# EAGLE design led-shift-r1 (EAGLE 6.5.0)
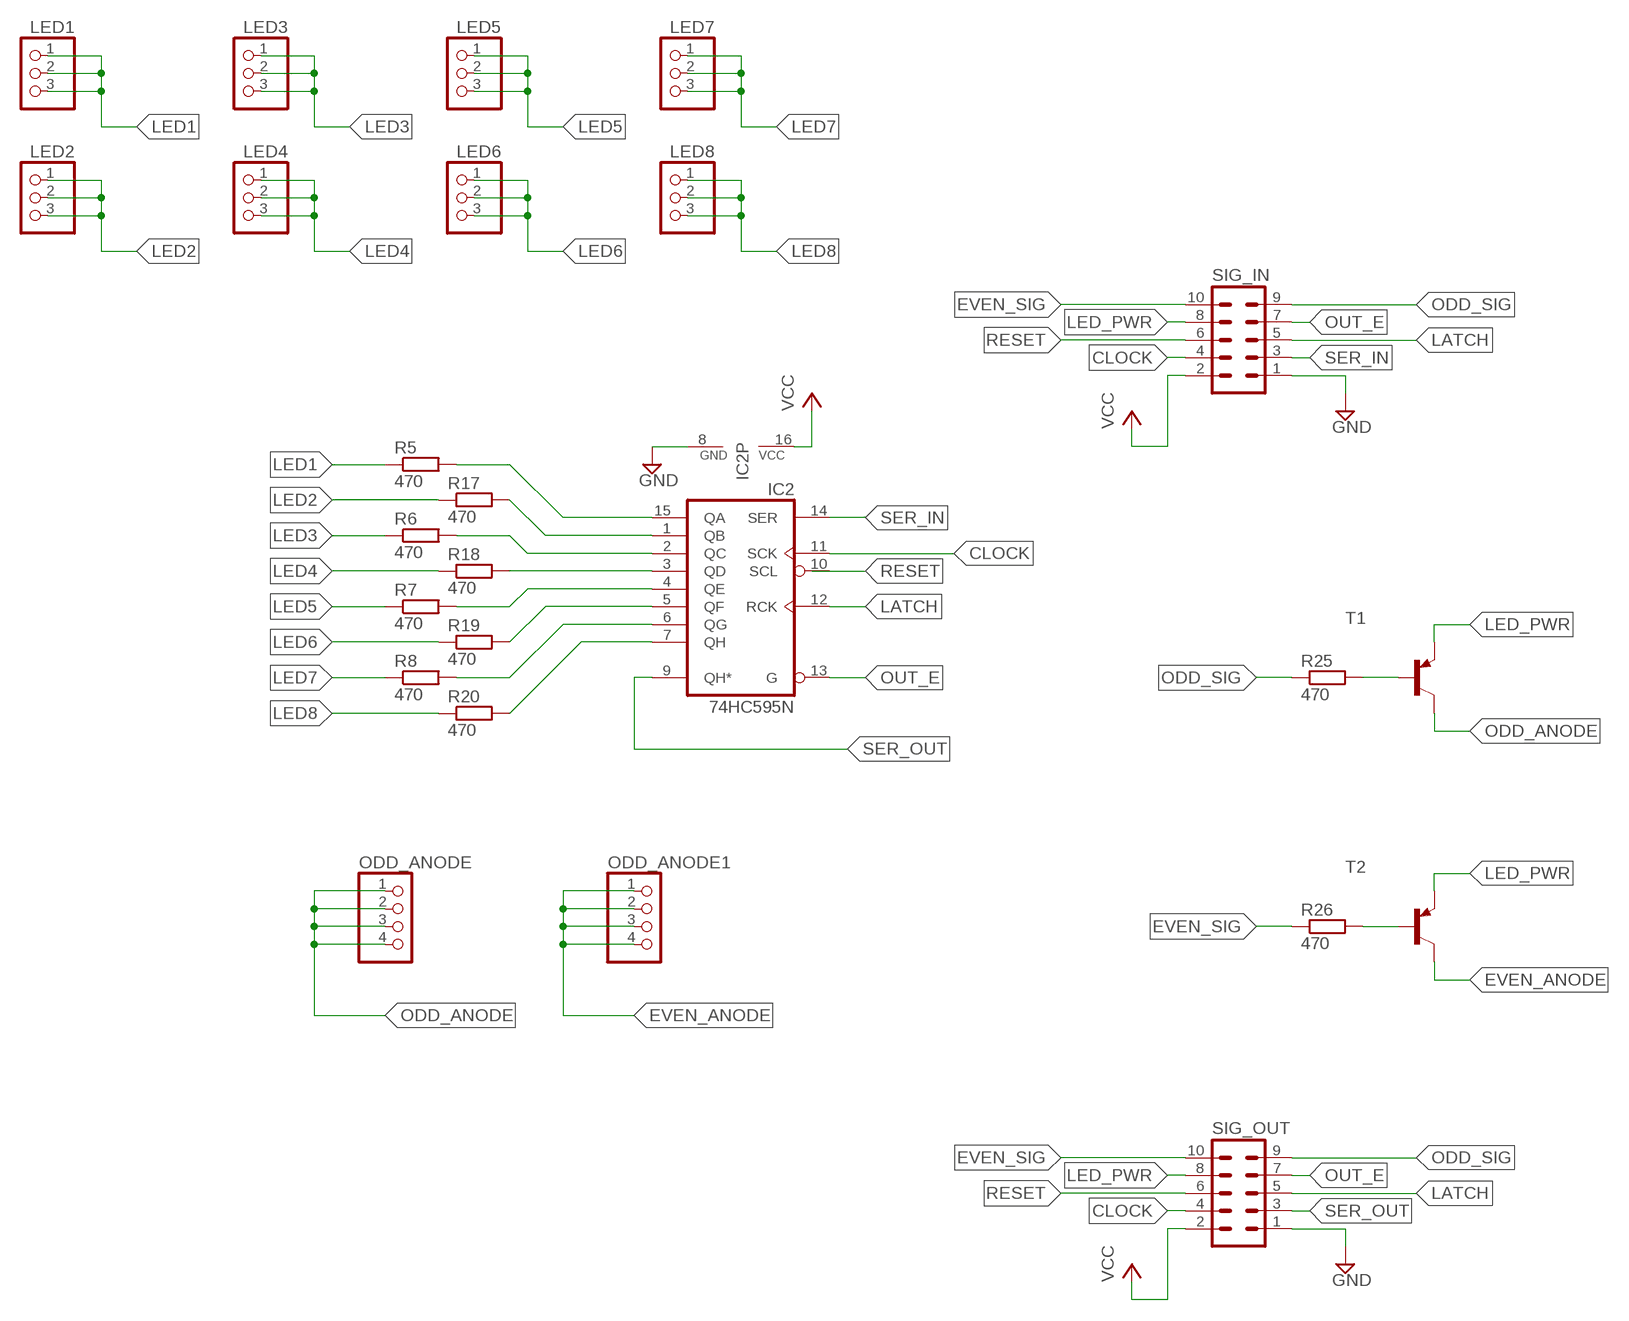
[diagram p0: schematic, sheet 1]

## Parts
IC2  74HC595N  [DIL16]
LED1  PINHD-1X3  [1X03]
LED2  PINHD-1X3  [1X03]
LED3  PINHD-1X3  [1X03]
LED4  PINHD-1X3  [1X03]
LED5  PINHD-1X3  [1X03]
LED6  PINHD-1X3  [1X03]
LED7  PINHD-1X3  [1X03]
LED8  PINHD-1X3  [1X03]
ODD_ANODE  PINHD-1X4  [1X04]
ODD_ANODE1  PINHD-1X4  [1X04]
R5  470  R-EU_R0805  [R0805]
R6  470  R-EU_R0805  [R0805]
R7  470  R-EU_R0805  [R0805]
R8  470  R-EU_R0805  [R0805]
R17  470  R-EU_R0805  [R0805]
R18  470  R-EU_R0805  [R0805]
R19  470  R-EU_R0805  [R0805]
R20  470  R-EU_R0805  [R0805]
R25  470  R-EU_R0805  [R0805]
R26  470  R-EU_R0805  [R0805]
SIG_IN  MA05-2  [MA05-2]
SIG_OUT  MA05-2  [MA05-2]
T1  BC557B-PNP-TO92-EBC  [TO92-EBC]
T2  BC557B-PNP-TO92-EBC  [TO92-EBC]

## Nets
CLOCK: IC2.11(SCK) SIG_IN.4 SIG_OUT.4
EVEN_ANODE: ODD_ANODE1.1 ODD_ANODE1.2 ODD_ANODE1.3 ODD_ANODE1.4 T2.C
EVEN_SIG: R26.1 SIG_IN.10 SIG_OUT.10
GND: IC2.8(GND) SIG_IN.1 SIG_OUT.1
LATCH: IC2.12(RCK) SIG_IN.5 SIG_OUT.5
LED1: LED1.1 LED1.2 LED1.3 R5.1
LED2: LED2.1 LED2.2 LED2.3 R17.1
LED3: LED3.1 LED3.2 LED3.3 R6.1
LED4: LED4.1 LED4.2 LED4.3 R18.1
LED5: LED5.1 LED5.2 LED5.3 R7.1
LED6: LED6.1 LED6.2 LED6.3 R19.1
LED7: LED7.1 LED7.2 LED7.3 R8.1
LED8: LED8.1 LED8.2 LED8.3 R20.1
LED_PWR: SIG_IN.8 SIG_OUT.8 T1.E T2.E
N$1: IC2.15(QA) R5.2
N$2: IC2.2(QC) R6.2
N$3: IC2.4(QE) R7.2
N$4: IC2.6(QG) R8.2
N$9: IC2.1(QB) R17.2
N$10: IC2.3(QD) R18.2
N$11: IC2.5(QF) R19.2
N$12: IC2.7(QH) R20.2
N$53: R26.2 T2.B
N$54: R25.2 T1.B
ODD_ANODE: ODD_ANODE.1 ODD_ANODE.2 ODD_ANODE.3 ODD_ANODE.4 T1.C
ODD_SIG: R25.1 SIG_IN.9 SIG_OUT.9
OUT_E: IC2.13(G) SIG_IN.7 SIG_OUT.7
RESET: SIG_IN.6 SIG_OUT.6
SER_IN: IC2.14(SER) SIG_IN.3
SER_OUT: IC2.9(QH*) SIG_OUT.3
VCC: IC2.16(VCC) SIG_IN.2 SIG_OUT.2
Unconnected: IC2.10(SCL)

## Library data of the parts
IC2 = 74xx-eu:74*595: 8-bit SHIFT REGISTER, output latch
LED1-LED8 = pinhead:PINHD-1X3: PIN HEADER
ODD_ANODE ODD_ANODE1 = pinhead:PINHD-1X4: PIN HEADER
R5-R8 R17-R20 R25 R26 = rcl:R-EU_: RESISTOR, European symbol
SIG_IN SIG_OUT = con-lstb:MA05-2: PIN HEADER; OC_FARNELL: unknown; OC_NEWARK: unknown
T1 T2 = transistor:*-PNP-: PNP Transistror

## Board
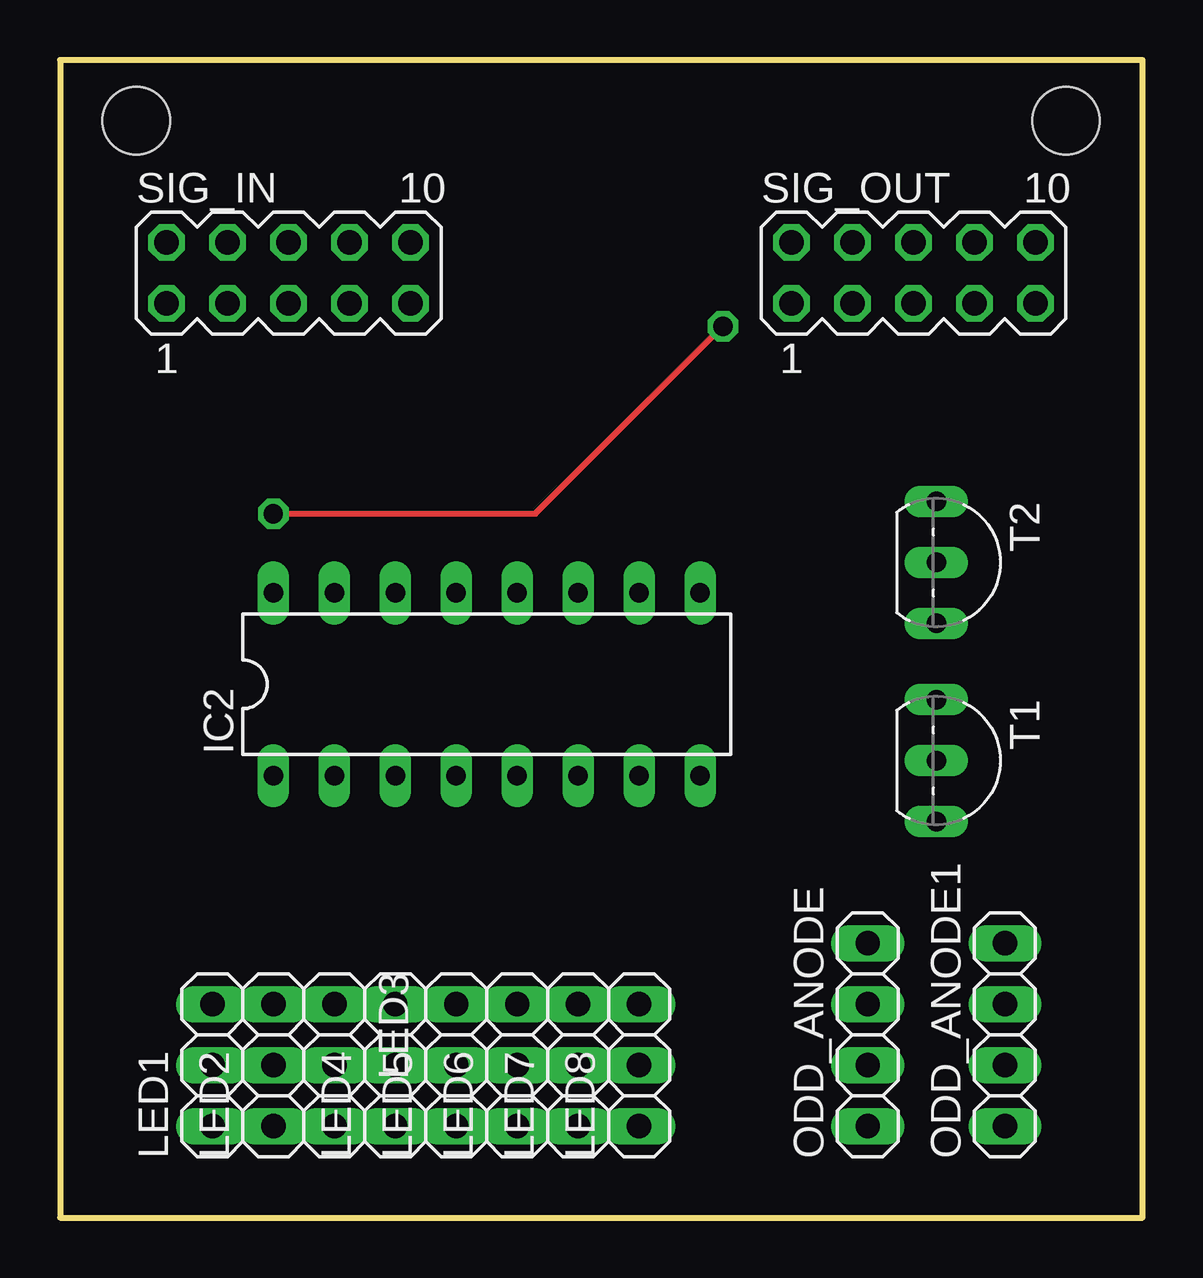
[diagram p1: board, top side]
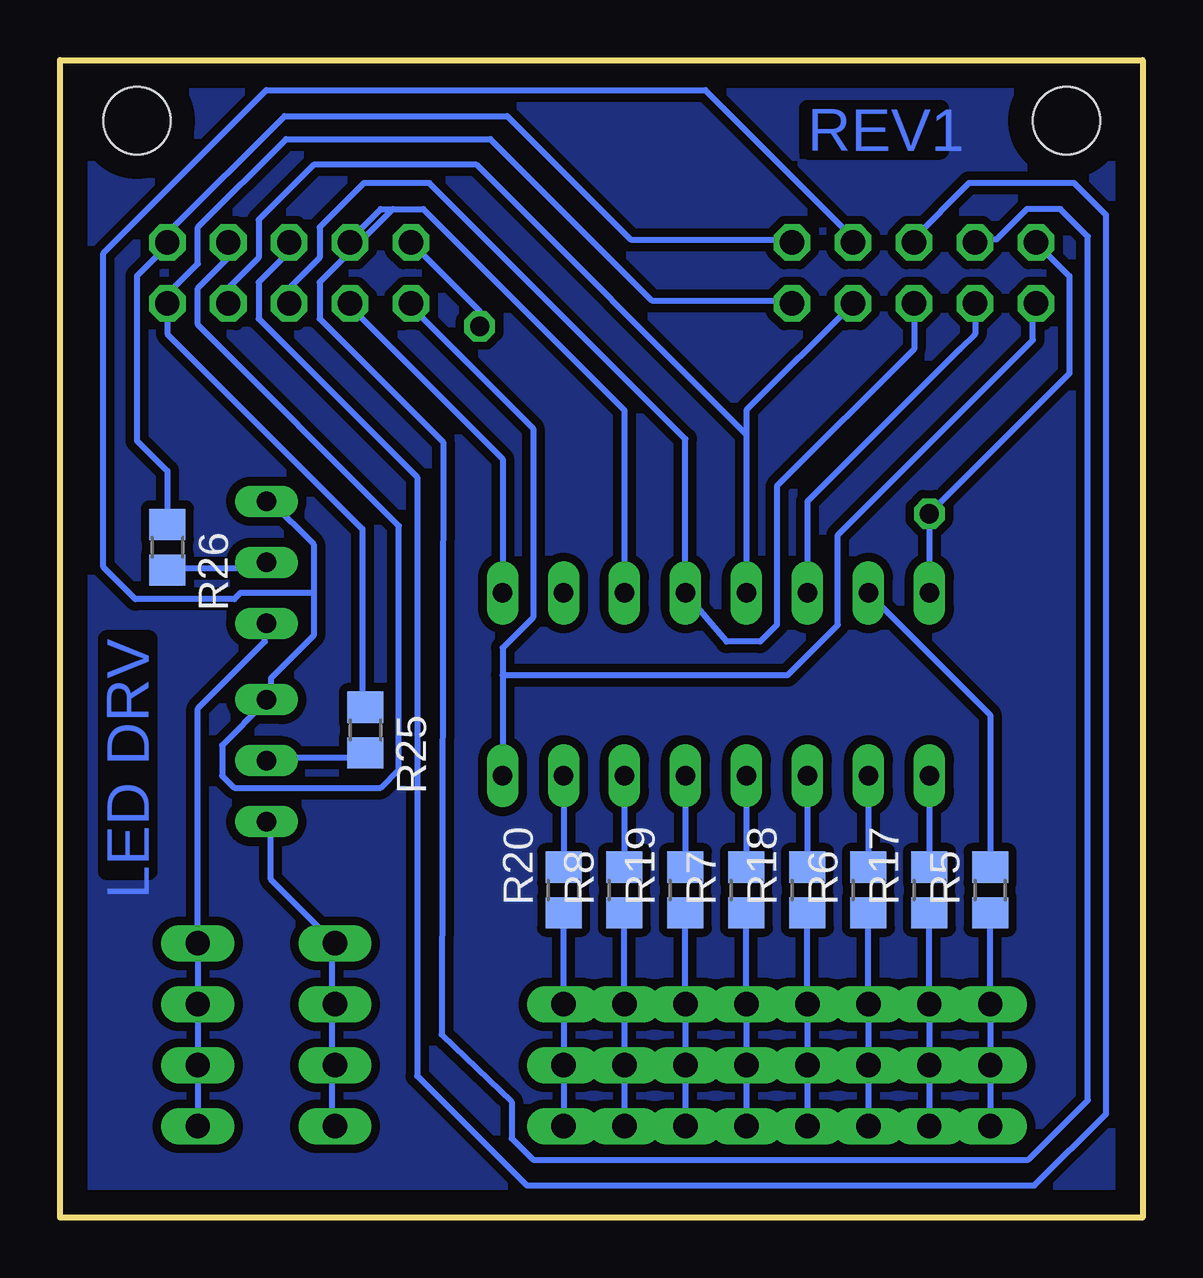
[diagram p2: board, bottom side, seen from below]

Size 45.11 x 48.25 mm. Coordinates in mm from the lower left corner, seen from the top.
Outline: 0,0 45.11,0 45.11,48.25 0,48.25 0,0
Copper layers (1*16): Top 0.035mm / dielectric 1.5mm / Bottom 0.035mm
Design rules "default *": minimum track width 10mil, minimum drill 24mil, track to track 14mil, track to pad 14mil, pad to pad 14mil, via to via 14mil, smd to smd 14mil, copper to edge 40mil, drill to drill 8mil, minimum pad ring 10mil, minimum via ring 8mil, stop-mask expansion 4mil, vias tented up to drill 0mil, thermal gap 10mil
Holes 2.8 mm at 3.17,45.72 41.91,45.72

### Footprints (pad centres in the part's own frame; a part is rotated, then mirrored left to right if it is on the bottom)
DIL16 = drill 0.813 long: 1 -8.89,-3.81; 2 -6.35,-3.81; 3 -3.81,-3.81; 4 -1.27,-3.81; 5 1.27,-3.81; 6 3.81,-3.81; 7 6.35,-3.81; 8 8.89,-3.81; 9 8.89,3.81; 10 6.35,3.81; 11 3.81,3.81; 12 1.27,3.81; 13 -1.27,3.81; 14 -3.81,3.81; 15 -6.35,3.81; 16 -8.89,3.81
1X03 = drill 1.016 long: 1 -2.54,0; 2 0,0; 3 2.54,0
1X04 = drill 1.016 long: 1 -3.81,0; 2 -1.27,0; 3 1.27,0; 4 3.81,0
R0805 = smd 1.3 x 1.5: 1 -0.95,0; 2 0.95,0
MA05-2 = drill 1.016 octagon: 1 -5.08,-1.27; 2 -5.08,1.27; 3 -2.54,-1.27; 4 -2.54,1.27; 5 0,-1.27; 6 0,1.27; 7 2.54,-1.27; 8 2.54,1.27; 9 5.08,-1.27; 10 5.08,1.27
TO92-EBC = drill 0.813 long: B 0,-1.27; C 2.54,-1.27; E -2.54,-1.27

### Placement (x,y rotation side)
IC2  17.78,22.23 0 top
LED1  6.35,6.35 90 top
LED2  8.89,6.35 90 top
LED3  11.43,6.35 270 top
LED4  13.97,6.35 90 top
LED5  16.51,6.35 90 top
LED6  19.05,6.35 90 top
LED7  21.59,6.35 90 top
LED8  24.13,6.35 90 top
ODD_ANODE  33.66,7.62 90 top
ODD_ANODE1  39.37,7.62 90 top
R5  6.35,13.65 90 bottom
R6  11.43,13.65 90 bottom
R7  16.51,13.65 90 bottom
R8  21.59,13.65 90 bottom
R17  8.89,13.65 90 bottom
R18  13.97,13.65 90 bottom
R19  19.05,13.65 90 bottom
R20  24.13,13.65 90 bottom
R25  32.38,20.32 270 bottom
R26  40.64,27.94 270 bottom
SIG_IN  9.53,39.37 0 top
SIG_OUT  35.56,39.37 0 top
T1  37.78,19.05 270 top
T2  37.78,27.3 270 top

### Tracks (layer width: path | path; a pad name or v marks a point on that pad's centre or on a via)
CLOCK
  Bottom 0.254: IC2.11 21.59,33.66 29.97,42.04 31.24,42.04 | 31.24,42.04 31.75,42.04 33.02,40.77 SIG_OUT.4 | 31.24,42.04 34.29,38.99 34.29,37.47 29.15,32.32 29.21,7.62 26.29,4.83 26.29,3.3 25.4,2.41 4.76,2.41 2.29,4.89 2.29,40.89 3.43,42.04 4.83,42.04 6.1,40.77 6.86,40.77 SIG_IN.4
EVEN_ANODE
  Bottom 0.254: ODD_ANODE1.1 ODD_ANODE1.2 ODD_ANODE1.3 ODD_ANODE1.4 39.37,21.21 36.58,24 36.58,24.77 T2.C
EVEN_SIG
  Bottom 0.254: R26.1 40.64,31.11 41.91,32.38 41.91,39.24 40.64,40.51 SIG_OUT.10 40.64,41.02 35.75,45.91 26.48,45.91 21.34,40.77 14.73,40.77 SIG_IN.10
GND
  Bottom 0.254: 26.67,22.61 26.67,23.75 25.4,25.02 25.4,32.89 30.48,37.97 SIG_OUT.1 | 26.67,22.61 IC2.8 | 26.67,22.61 14.8,22.61 12.7,24.7 12.7,28.45 4.57,36.58 4.57,37.97 SIG_IN.1
LATCH
  Bottom 0.254: SIG_IN.5 9.53,36.2 15.24,30.48 15.24,24.7 15.94,24 17.34,24 IC2.12 19.05,32.45 29.72,43.12 32.45,43.12 34.29,41.27 34.29,40.01 35.56,38.73 SIG_OUT.5
LED1
  Bottom 0.254: LED1.1 LED1.2 LED1.3 R5.1
LED2
  Bottom 0.254: LED2.1 LED2.2 LED2.3 R17.1
LED3
  Bottom 0.254: LED3.3 LED3.2 LED3.1 R6.1
LED4
  Bottom 0.254: LED4.1 LED4.2 LED4.3 R18.1
LED5
  Bottom 0.254: LED5.1 LED5.2 LED5.3 R7.1
LED6
  Bottom 0.254: LED6.1 LED6.2 LED6.3 R19.1
LED7
  Bottom 0.254: LED7.1 LED7.2 LED7.3 R8.1
LED8
  Bottom 0.254: LED8.1 LED8.2 LED8.3 R20.1
LED_PWR
  Bottom 0.254: 34.54,26.04 34.54,28.07 36.32,29.84 T2.E | 34.54,26.04 34.54,24.26 36.32,22.48 36.32,21.72 T1.E 36.58,21.46 38.35,19.68 38.35,18.41 37.85,17.91 31.75,17.91 30.99,18.67 30.99,28.83 39.37,37.21 39.37,38.73 38.1,40.01 SIG_OUT.8 | 34.54,26.04 37.59,26.04 37.85,25.78 41.97,25.78 43.31,27.11 43.31,40.2 36.51,46.99 18.22,46.99 12,40.77 12.19,40.77 SIG_IN.8
N$1
  Bottom 0.254: R5.2 6.35,20.95 IC2.15
N$2
  Bottom 0.254: IC2.2 R6.2
N$3
  Bottom 0.254: IC2.4 R7.2
N$4
  Bottom 0.254: IC2.6 R8.2
N$9
  Bottom 0.254: IC2.1 R17.2
N$10
  Bottom 0.254: IC2.3 R18.2
N$11
  Bottom 0.254: IC2.5 R19.2
N$12
  Bottom 0.254: IC2.7 R20.2
N$34
  pour Bottom: 0,47.62 45.09,48.26 44.45,0 -0.64,-0.64
N$53
  Bottom 0.254: R26.2 40.64,27.05 36.83,27.05 36.58,27.3 T2.B
N$54
  Bottom 0.254: R25.2 32.51,19.18 36.32,19.18 T1.B
ODD_ANODE
  Bottom 0.254: ODD_ANODE.1 33.78,3.94 33.78,6.22 ODD_ANODE.2 33.78,6.48 33.78,8.76 ODD_ANODE.3 33.78,9.02 33.78,11.3 ODD_ANODE.4 36.32,14.1 36.32,16.38 T1.C
ODD_SIG
  Bottom 0.254: R25.1 32.51,21.46 32.51,28.7 40.64,36.83 SIG_OUT.9 40.64,38.48 39.37,39.75 39.37,41.27 35.69,44.96 27.18,44.96 20.45,38.23 14.73,38.23 SIG_IN.9
OUT_E
  Bottom 0.254: 16.51,32.64 16.51,33.66 SIG_IN.7 | 16.51,32.64 IC2.13 | SIG_OUT.7 38.1,38.73 36.83,40.01 36.83,41.59 34.54,43.88 27.75,43.88 16.51,32.64
RESET
  Bottom 0.254: SIG_OUT.6 35.56,40.26 36.83,38.99 36.83,37.47 30.23,30.86 30.23,5.91 25.65,1.33 4.51,1.33 1.52,4.32 1.52,41.78 2.86,43.12 7.24,43.12 9.59,40.77 9.4,40.77 SIG_IN.6
SER_IN
  Bottom 0.254: IC2.14 13.97,29.84 7.62,36.2 6.99,36.83 SIG_IN.3
SER_OUT
  Bottom 0.254: IC2.9 26.67,31.62 33.02,37.97 SIG_OUT.3
VCC  (via drill 0.8 pad 1.27)
  Top 0.254: v8.89,29.34 19.81,29.34 v27.62,37.15
  Bottom 0.254: IC2.16 v8.89,29.34 3.05,35.18 3.05,39.24 SIG_IN.2 | v27.62,37.15 27.62,37.78 SIG_OUT.2

### Text on the board
Bottom: REV1 | LED DRV